# Altium schematic sheet 3V3_LDO.SchDoc
size A4; ApprovedBy: Mateusz Kowalik; CheckedBy: Mateusz Kowalik; Author: Mateusz Kowalik; CompanyName: InMotion Labs sp. z o.o.; DrawnBy: Mateusz Kowalik; Engineer: Mateusz Kowalik; Organization: InMotion Labs sp. z o.o.; Address1: Rydlówka 5A; Address2: 30-363 Kraków; Address4: Poland; DocumentNumber: 6; Revision: Rev 0; SheetNumber: 5; SheetTotal: 17
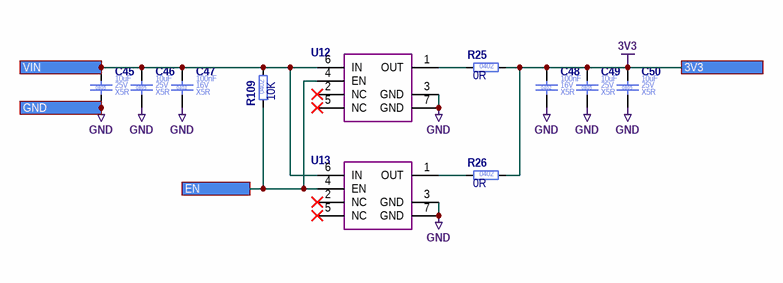
[diagram p0: 3V3_LDO.SchDoc]

## Parts
C45  Case/Package: 0805  Voltage Rating (DC): 25V  Dielectric: X5R  Capacitance: 10uF  [C_0805_2012]  (hidden comment: C_10UF_25V_X5R_0805_10)
C46  Case/Package: 0805  Voltage Rating (DC): 25V  Dielectric: X5R  Capacitance: 10uF  [C_0805_2012]  (hidden comment: C_10UF_25V_X5R_0805_10)
C47  Case/Package: 0402  Voltage Rating (DC): 16V  Dielectric: X5R  Capacitance: 100nF  [C_0402_1005]  (hidden comment: C_100NF_16V_X5R_0402_10)
C48  Case/Package: 0402  Voltage Rating (DC): 16V  Dielectric: X5R  Capacitance: 100nF  [C_0402_1005]  (hidden comment: C_100NF_16V_X5R_0402_10)
C49  Case/Package: 0805  Voltage Rating (DC): 25V  Dielectric: X5R  Capacitance: 10uF  [C_0805_2012]  (hidden comment: C_10UF_25V_X5R_0805_10)
C50  Case/Package: 0805  Voltage Rating (DC): 25V  Dielectric: X5R  Capacitance: 10uF  [C_0805_2012]  (hidden comment: C_10UF_25V_X5R_0805_10)
R25  Resistance: 0R  Case/Package: 0402  [R_0402_1005]  (hidden comment: R_0R_0402_1)
R26  Resistance: 0R  Case/Package: 0402  [R_0402_1005]  (hidden comment: R_0R_0402_1)
R109  Resistance: 10K  Case/Package: 0402  [R_0402_1005]  (hidden comment: R_10K_0402_1)
U12  NCV8705MT33TCG  [WDFN6]  (value not drawn)
U13  NCV8705MT33TCG  [WDFN6]  (value not drawn)

## Ports
3V3, EN, GND, VIN

## Nets
3V3: C48.1 C49.1 C50.1 R25.2 R26.2 ; port 3V3
GND: C45.2 C46.2 C47.2 C48.2 C49.2 C50.2 U12.3(GND) U12.7(GND) U13.3(GND) U13.7(GND) ; port GND
EN: R109.1 U12.4(EN) U13.4(EN) ; port EN
VIN: C45.1 C46.1 C47.1 R109.2 U12.6(IN) U13.6(IN) ; port VIN
NetR25_1: R25.1 U12.1(OUT)
NetR26_1: R26.1 U13.1(OUT)

Not connected (* = marked no-connect by the designer): U12 2(NC)* 5(NC)*; U13 2(NC)* 5(NC)*

## Notes on the sheet
- Title
- Size:
- Date:
- A4

## Library data of the parts
C45 C46 C49 C50 = C_10UF_25V_X5R_0805_10: Ceramic Capacitor; Manufacturer Part Number: CL21A106KAYNNNE; Manufacturer: Samsung Electro-Mechanics; Value: 10uF; Tolerance: 10%; Part Number: C_10UF_25V_X5R_0805_10; Mount: Surface Mount; Height: 1.35mm; HelpURL: https://pl.mouser.com/datasheet/2/585/MLCC-1837944.pdf; RoHS: Compliant; Max Operating Temperature: 85°C; Status: MK; Supplier 1: Mouser; Supplier Part Number 1: 187-CL21A106KAYNNNE; Supplier 2: LCSC; Supplier Part Number 2: C15850; Manufacturer 2: Samsung Electro-Mechanics; Manufacturer Part Number 2: CL21A106KAYNNNE
C47 C48 = C_100NF_16V_X5R_0402_10: Ceramic Capacitor; Manufacturer Part Number: EMK105BJ104KV-F; Manufacturer: Taiyo Yuden; Value: 100nF; Tolerance: 10%; Part Number: C_100NF_16V_X5R_0402_10; Mount: Surface Mount; Height: 500um; HelpURL: http://datasheet.octopart.com/EMK105BJ104KV-F-Taiyo-Yuden-datasheet-8857305.pdf; RoHS: Compliant; Max Operating Temperature: 125°C; Status: MK; Supplier 1: Mouser; Supplier Part Number 1: 963-EMK105BJ104KV-F; Manufacturer 2: Samsung Electro-Mechanics; Manufacturer Part Number 2: CL05B104KO5NNNC; Supplier 2: LCSC; Supplier Part Number 2: C1525
R25 R26 = R_0R_0402_1: Thick Film Resistor; Manufacturer: Yageo; Manufacturer Part Number: RC0402FR-070RL; Value: 0R; Tolerance: 1%; Voltage Rating (DC): 50V; Power Rating: 63mW; Stats: MK; Part Number: R_0R_0402_1; Mount: Surface Mount; Height: 350um; HelpURL: http://datasheet.octopart.com/2176049-1-TE-Connectivity---AMP-datasheet-11120217.pdf; RoHS: Compliant; Max Operating Temperature: 155°C; Supplier 1: Mouser; Supplier Part Number 1: 603-RC0402FR-070RL; Manufacturer 2: Uniroyal Elec; Manufacturer Part Number 2: 0402WGF0000TCE; Supplier 2: LCSC; Supplier Part Number 2: C17168
R109 = R_10K_0402_1: Thick Film Resistor; Manufacturer: Yageo; Manufacturer Part Number: RC0402FR-7W10KL; Value: 10K; Tolerance: 1%; Voltage Rating (DC): 50V; Power Rating: 63mW; Stats: MK; Part Number: R_10K_0402_1; Mount: Surface Mount; Height: 350um; HelpURL: https://pl.mouser.com/datasheet/2/447/PYu-RC_Group_51_RoHS_L_10-1664068.pdf; RoHS: Compliant; Max Operating Temperature: 155°C; Supplier 1: Mouser; Supplier Part Number 1: 603-RC0402FR-7W10KL; Manufacturer 2: Uniroyal Elec; Manufacturer Part Number 2: 0402WGF1002TCE; Supplier 2: LCSC; Supplier Part Number 2: C25744
U12 U13 = NCV8705MT33TCG: Low Dropout, Ultra-Low Iq, High PSRR, Ultra-Low Noise 3.3V; Manufacturer: ON Semiconductor; Max Output Current: 500mA; Polarity: Positive; Output Type: Fixed; Accuracy: 0.02; Dropout Voltage: 230mV; Max Input Voltage: 5.5V; Min Input Voltage: 2.5V; Quiescent Current: 13uA; Reference Voltage: 800mV; Box: 220; Part Number: NCV8705MT33TCG; Manufacturer Part Number: NCV8705MT33TCG; Mount: Surface Mount; Nominal Output Voltage: 3.3V; Case/Package: WDFN6; HelpURL: https://datasheet.octopart.com/NCV8705MT33TCG-ON-Semiconductor-datasheet-37177231.pdf; Max Operating Temperature: 150°C; Max Output Voltage: 3.3V; Min Output Voltage: 3.3V; Number of Pins: 7; RoHS: Compliant; Status: MK; Stock: 9; Supplier 1: Mouser; Supplier Part Number 1: 863-NCV8705MT33TCG